# EAGLE schematic Practicum_Schematic (EAGLE 7.1.0)
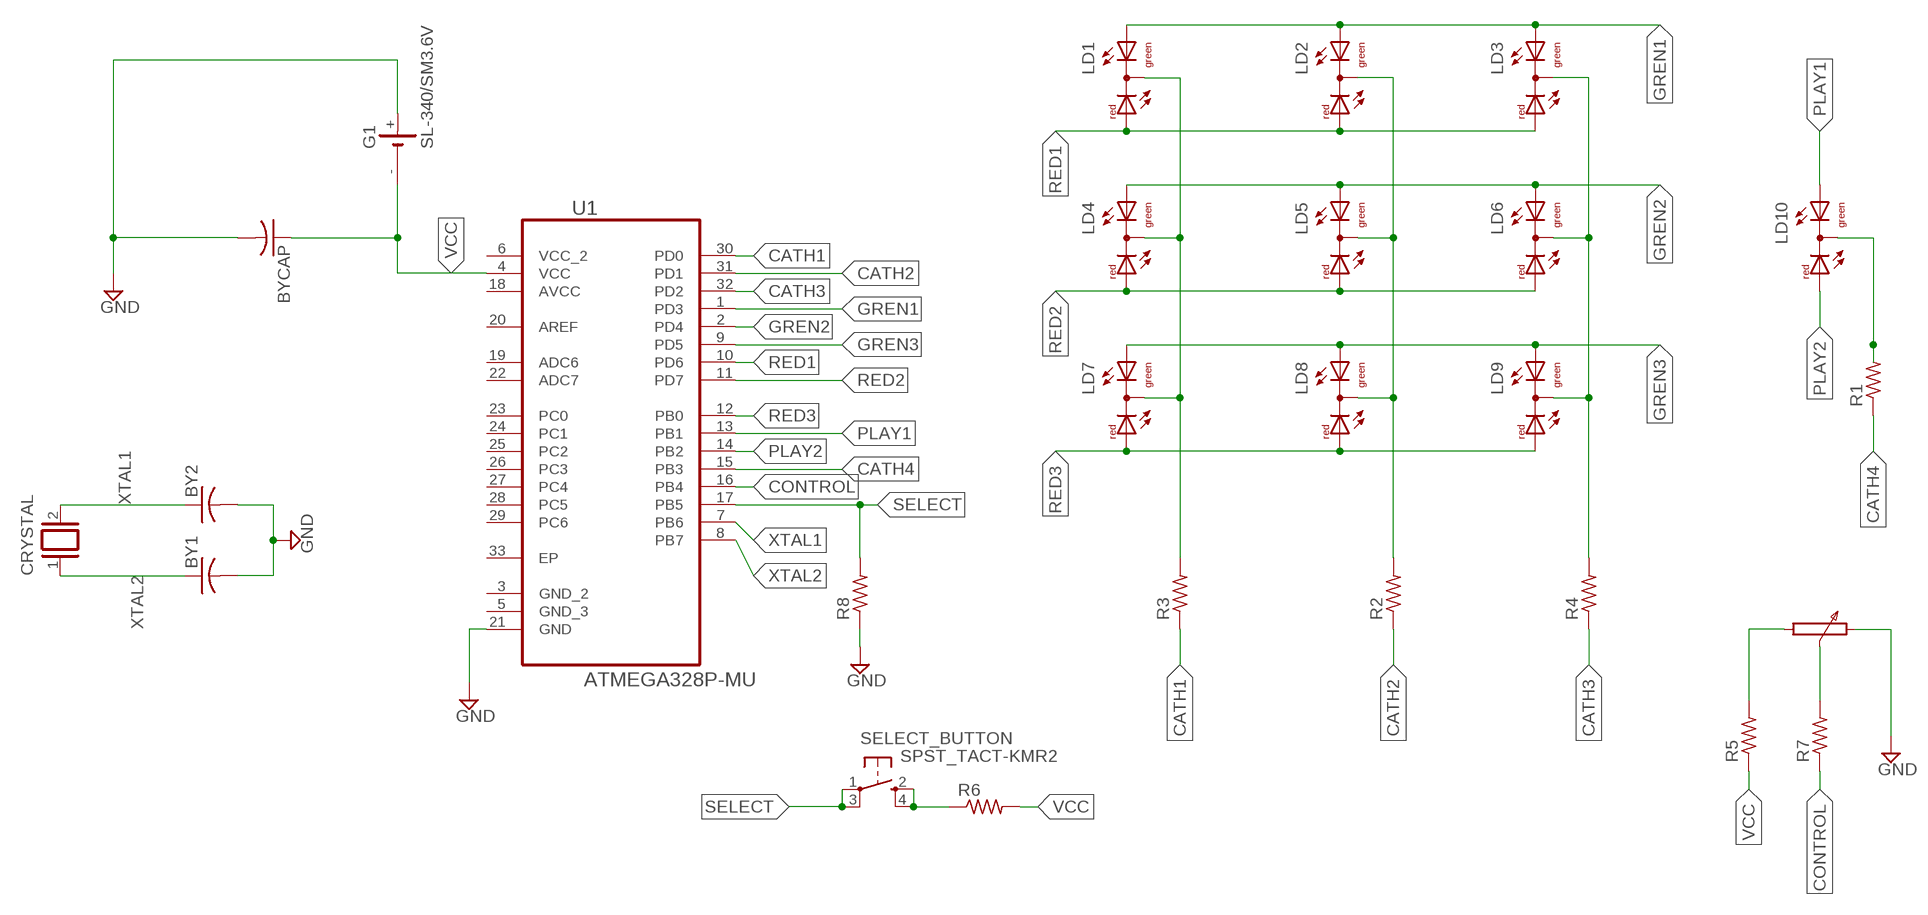
[diagram p0: schematic, sheet 1]

## Parts
BY1  C-USC0805  [C0805]
BY2  C-USC0805  [C0805]
BYCAP  C-USC0805  [C0805]
CRYSTAL  XTAL/S  [QS]
G1  SL-340/SM3.6V  [SL-340/SM3.6V]
LD1  DUOLED-RG-C  [DUOLED-C-5MM]
LD2  DUOLED-RG-C  [DUOLED-C-5MM]
LD3  DUOLED-RG-C  [DUOLED-C-5MM]
LD4  DUOLED-RG-C  [DUOLED-C-5MM]
LD5  DUOLED-RG-C  [DUOLED-C-5MM]
LD6  DUOLED-RG-C  [DUOLED-C-5MM]
LD7  DUOLED-RG-C  [DUOLED-C-5MM]
LD8  DUOLED-RG-C  [DUOLED-C-5MM]
LD9  DUOLED-RG-C  [DUOLED-C-5MM]
LD10  DUOLED-RG-C  [DUOLED-C-5MM]
R1  R-US_M0805  [M0805]
R2  R-US_M0805  [M0805]
R3  R-US_M0805  [M0805]
R4  R-US_M0805  [M0805]
R5  R-US_M0805  [M0805]
R6  R-US_M0805  [M0805]
R7  R-US_M0805  [M0805]
R8  R-US_M0805  [M0805]
SELECT_BUTTON  SPST_TACT-KMR2  [KMR2]
U1  ATMEGA328P-MU  [QFN50P500X500X100-33N]

## Nets
CATH1: R3.1 U1.30(PD0)
CATH2: R2.1 U1.31(PD1)
CATH3: R4.1 U1.32(PD2)
CATH4: R1.1 U1.15(PB3)
CONTROL: R7.1 U1.16(PB4)
GND: BY1.2 BY2.2 BYCAP.2 G1.+ R8.1 U1.21(GND)
GREN1: LD1.AX(AG) LD2.AX(AG) LD3.AX(AG) U1.1(PD3)
GREN2: LD4.AX(AG) LD5.AX(AG) LD6.AX(AG) U1.2(PD4)
GREN3: LD7.AX(AG) LD8.AX(AG) LD9.AX(AG) U1.9(PD5)
N$1: LD1.C LD4.C LD7.C R3.2
N$2: R6.1 SELECT_BUTTON.2(S) SELECT_BUTTON.4(S1)
N$3: LD2.C LD5.C LD8.C R2.2
N$4: R5.2
N$5: R7.2
N$6: LD3.C LD6.C LD9.C R4.2
N$10: LD10.C R1.2
PLAY1: LD10.AX(AG) U1.13(PB1)
PLAY2: LD10.AR U1.14(PB2)
RED1: LD1.AR LD2.AR LD3.AR U1.10(PD6)
RED2: LD4.AR LD5.AR LD6.AR U1.11(PD7)
RED3: LD7.AR LD8.AR LD9.AR U1.12(PB0)
SELECT: R8.2 SELECT_BUTTON.1(P) SELECT_BUTTON.3(P1) U1.17(PB5)
VCC: BYCAP.1 G1.- R5.1 R6.2 U1.4(VCC)
XTAL1: BY2.1 CRYSTAL.2 U1.7(PB6)
XTAL2: BY1.1 CRYSTAL.1 U1.8(PB7)
Unconnected: G1.-@1(-) U1.3(GND_2) U1.5(GND_3) U1.19(ADC6) U1.20(AREF) U1.22(ADC7) U1.23(PC0) U1.24(PC1) U1.25(PC2) U1.26(PC3) U1.27(PC4) U1.28(PC5) U1.29(PC6) U1.33(EP)

## Power pins joined to a net without a drawn wire
AVCC: U1.18(AVCC)
VCC_2: U1.6(VCC_2)

## Library data of the parts
BY1 BY2 BYCAP = adafruit:C-US: CAPACITOR, American symbol
CRYSTAL = special:XTAL/S: CRYSTAL
G1 = battery:SL-340/SM3.6V: LI BATTERY Sonnenschein
LD1-LD10 = led:DUOLED-RG-C: DUO LED 2 colors (red/green), 5 mm, round, common Cathode www.ligitek.com or other producers.
R1-R8 = adafruit:R-US_: RESISTOR, American symbol
SELECT_BUTTON = adafruit:SPST_TACT: SMT 6mm switch, EVQQ2 series http://www.ladyada.net/library/eagle
U1 = Ava:ATMEGA328P-MU: Programmable Flash; MPN: ATMEGA328P-MU; OC_FARNELL: 1748522; OC_NEWARK: 26R2526; PACKAGE: QFN-32; SUPPLIER: Atmel